# EAGLE design HS(LED)V1 (EAGLE 8.3.0)
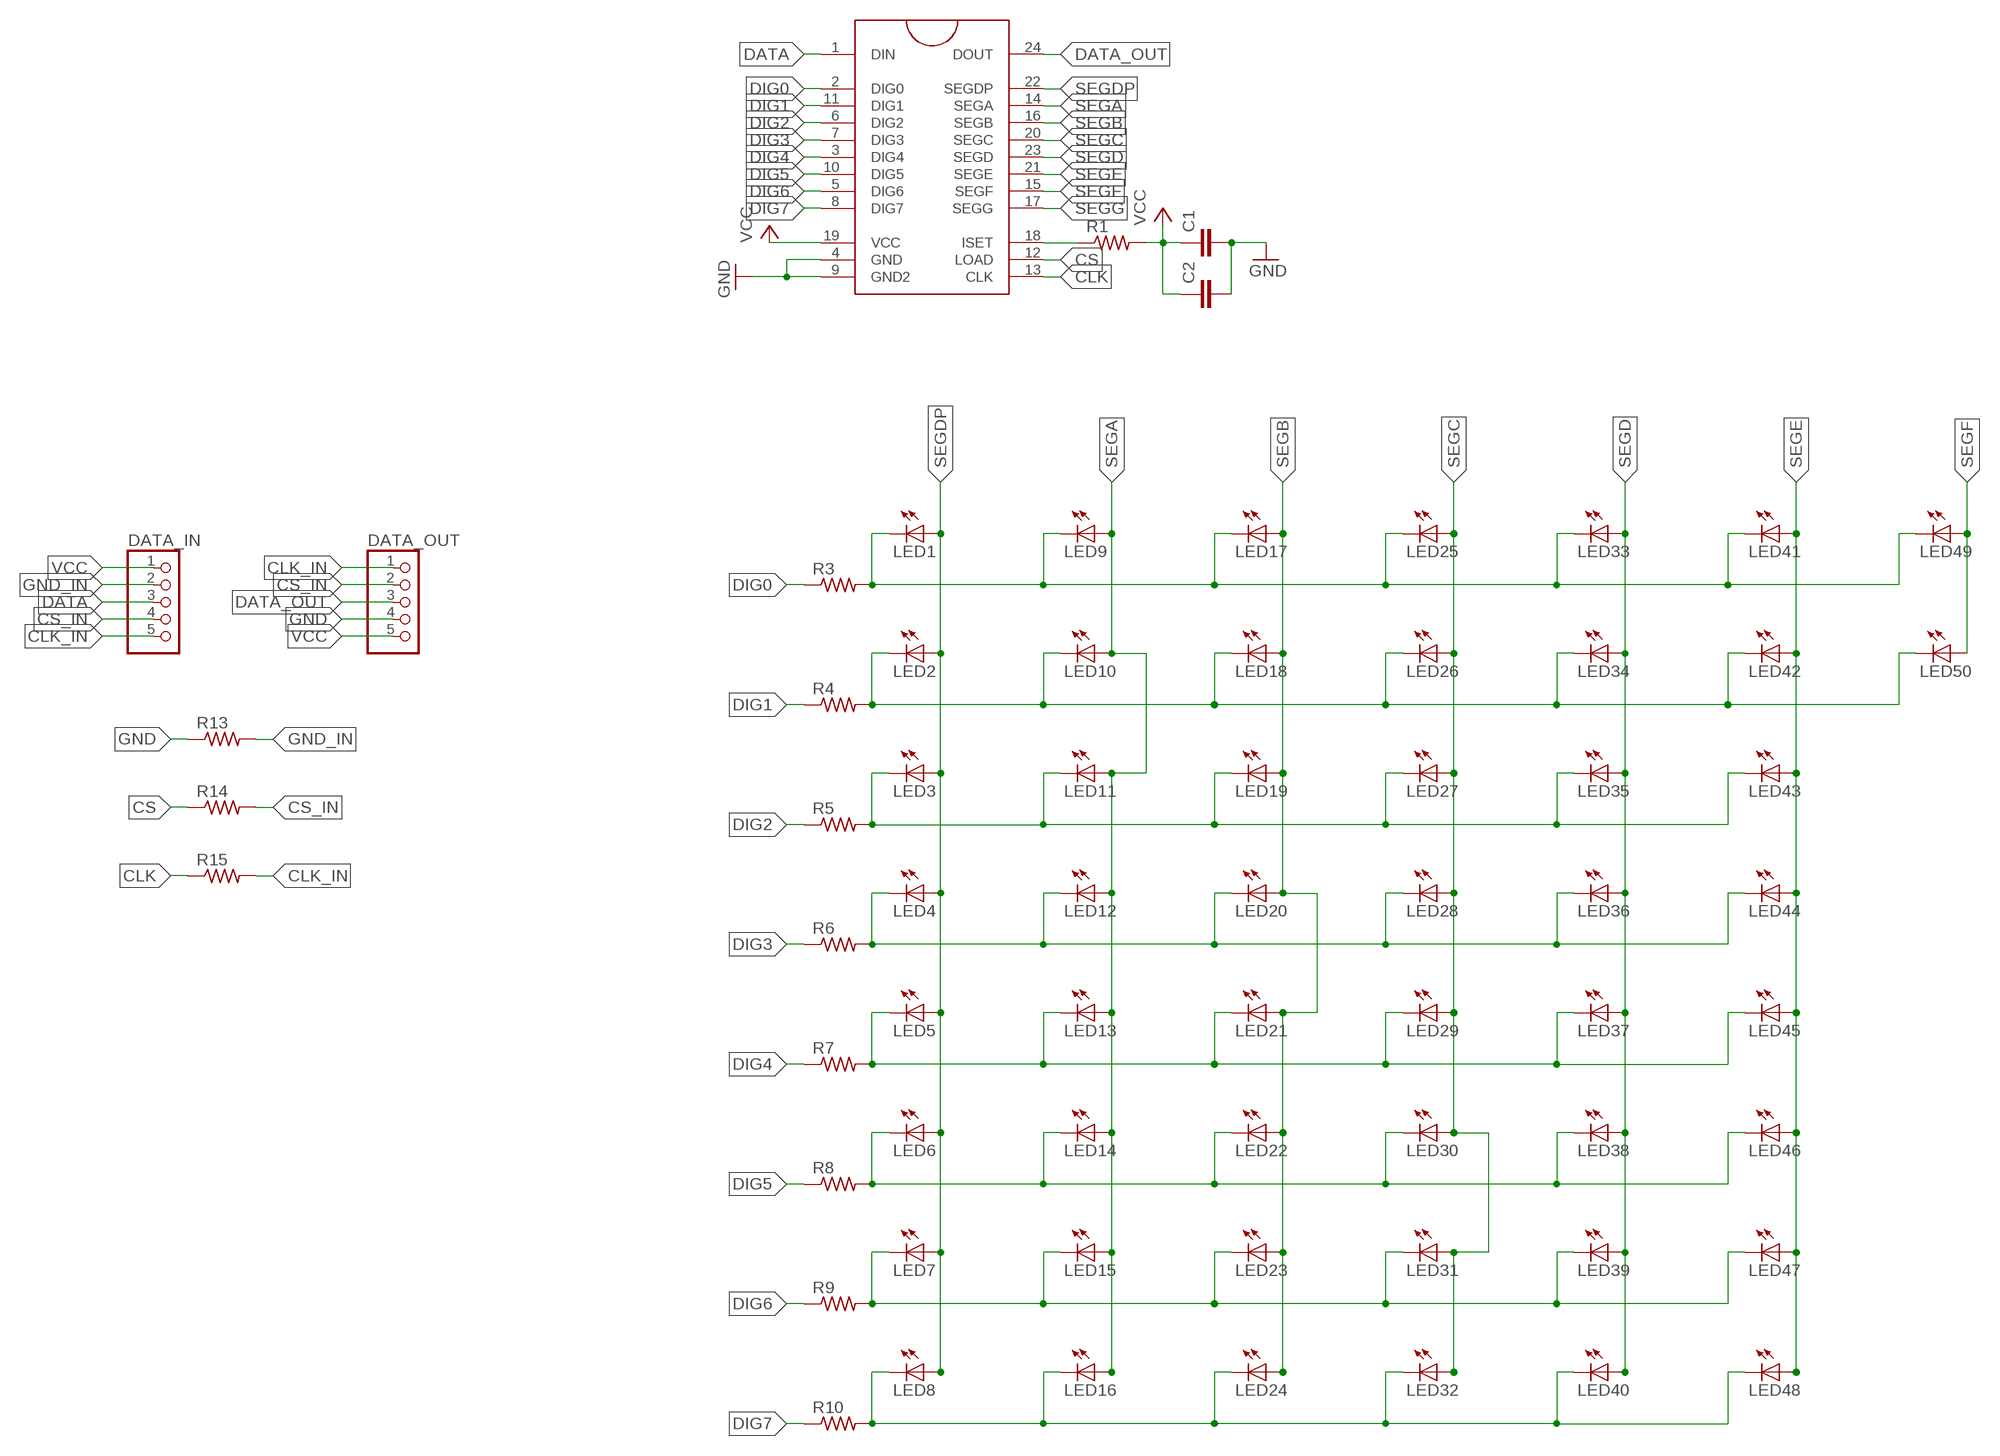
[diagram p0: schematic, sheet 1]

## Parts
C1  C-EU025-024X044  [C025-024X044]
C2  C-EU025-024X044  [C025-024X044]
DATA_IN  PINHD-1X5/90  [1X05/90]
DATA_OUT  PINHD-1X5/90  [1X05/90]
LED1  LED3MM  [LED3MM]
LED2  LED3MM  [LED3MM]
LED3  LED3MM  [LED3MM]
LED4  LED3MM  [LED3MM]
LED5  LED3MM  [LED3MM]
LED6  LED3MM  [LED3MM]
LED7  LED3MM  [LED3MM]
LED8  LED3MM  [LED3MM]
LED9  LED3MM  [LED3MM]
LED10  LED3MM  [LED3MM]
LED11  LED3MM  [LED3MM]
LED12  LED3MM  [LED3MM]
LED13  LED3MM  [LED3MM]
LED14  LED3MM  [LED3MM]
LED15  LED3MM  [LED3MM]
LED16  LED3MM  [LED3MM]
LED17  LED3MM  [LED3MM]
LED18  LED3MM  [LED3MM]
LED19  LED3MM  [LED3MM]
LED20  LED3MM  [LED3MM]
LED21  LED3MM  [LED3MM]
LED22  LED3MM  [LED3MM]
LED23  LED3MM  [LED3MM]
LED24  LED3MM  [LED3MM]
LED25  LED3MM  [LED3MM]
LED26  LED3MM  [LED3MM]
LED27  LED3MM  [LED3MM]
LED28  LED3MM  [LED3MM]
LED29  LED3MM  [LED3MM]
LED30  LED3MM  [LED3MM]
LED31  LED3MM  [LED3MM]
LED32  LED3MM  [LED3MM]
LED33  LED3MM  [LED3MM]
LED34  LED3MM  [LED3MM]
LED35  LED3MM  [LED3MM]
LED36  LED3MM  [LED3MM]
LED37  LED3MM  [LED3MM]
LED38  LED3MM  [LED3MM]
LED39  LED3MM  [LED3MM]
LED40  LED3MM  [LED3MM]
LED41  LED3MM  [LED3MM]
LED42  LED3MM  [LED3MM]
LED43  LED3MM  [LED3MM]
LED44  LED3MM  [LED3MM]
LED45  LED3MM  [LED3MM]
LED46  LED3MM  [LED3MM]
LED47  LED3MM  [LED3MM]
LED48  LED3MM  [LED3MM]
LED49  LED3MM  [LED3MM]
LED50  LED3MM  [LED3MM]
R1  R-US_0207/10  [0207/10]
R3  R-US_0207/10  [0207/10]
R4  R-US_0207/10  [0207/10]
R5  R-US_0207/10  [0207/10]
R6  R-US_0207/10  [0207/10]
R7  R-US_0207/10  [0207/10]
R8  R-US_0207/10  [0207/10]
R9  R-US_0207/10  [0207/10]
R10  R-US_0207/10  [0207/10]
R13  R-US_0207/10  [0207/10]
R14  R-US_0207/10  [0207/10]
R15  R-US_0207/10  [0207/10]
U$1  MAX7219DIP  [DIL24]

## Nets
CLK: R15.1 U$1.13(CLK)
CLK_IN: DATA_IN.5 DATA_OUT.1 R15.2
CS: R14.1 U$1.12(LOAD)
CS_IN: DATA_IN.4 DATA_OUT.2 R14.2
DATA: DATA_IN.3 U$1.1(DIN)
DATA_OUT: DATA_OUT.3 U$1.24(DOUT)
DIG0: R3.1 U$1.2(DIG0)
DIG1: R4.1 U$1.11(DIG1)
DIG2: R5.1 U$1.6(DIG2)
DIG3: R6.1 U$1.7(DIG3)
DIG4: R7.1 U$1.3(DIG4)
DIG5: R8.1 U$1.10(DIG5)
DIG6: R9.1 U$1.5(DIG6)
DIG7: R10.1 U$1.8(DIG7)
GND: C1.2 C2.2 DATA_OUT.4 R13.1 U$1.4(GND) U$1.9(GND2)
GND_IN: DATA_IN.2 R13.2
L0: LED1.K(C) LED9.K(C) LED17.K(C) LED25.K(C) LED33.K(C) LED41.K(C) LED49.K(C) R3.2
L1: LED2.K(C) LED10.K(C) LED18.K(C) LED26.K(C) LED34.K(C) LED42.K(C) LED50.K(C) R4.2
L2: LED3.K(C) LED11.K(C) LED19.K(C) LED27.K(C) LED35.K(C) LED43.K(C) R5.2
L3: LED4.K(C) LED12.K(C) LED20.K(C) LED28.K(C) LED36.K(C) LED44.K(C) R6.2
L4: LED5.K(C) LED13.K(C) LED21.K(C) LED29.K(C) LED37.K(C) LED45.K(C) R7.2
L5: LED6.K(C) LED14.K(C) LED22.K(C) LED30.K(C) LED38.K(C) LED46.K(C) R8.2
L6: LED7.K(C) LED15.K(C) LED23.K(C) LED31.K(C) LED39.K(C) LED47.K(C) R9.2
L7: LED8.K(C) LED16.K(C) LED24.K(C) LED32.K(C) LED40.K(C) LED48.K(C) R10.2
N$18: R1.1 U$1.18(ISET)
SEGA: LED9.A LED10.A LED11.A LED12.A LED13.A LED14.A LED15.A LED16.A U$1.14(SEGA)
SEGB: LED17.A LED18.A LED19.A LED20.A LED21.A LED22.A LED23.A LED24.A U$1.16(SEGB)
SEGC: LED25.A LED26.A LED27.A LED28.A LED29.A LED30.A LED31.A LED32.A U$1.20(SEGC)
SEGD: LED33.A LED34.A LED35.A LED36.A LED37.A LED38.A LED39.A LED40.A U$1.23(SEGD)
SEGDP: LED1.A LED2.A LED3.A LED4.A LED5.A LED6.A LED7.A LED8.A U$1.22(SEGDP)
SEGE: LED41.A LED42.A LED43.A LED44.A LED45.A LED46.A LED47.A LED48.A U$1.21(SEGE)
SEGF: LED49.A LED50.A U$1.15(SEGF)
SEGG: U$1.17(SEGG)
VCC: C1.1 C2.1 DATA_IN.1 DATA_OUT.5 R1.2 U$1.19(VCC)

## Library data of the parts
C1 C2 = resistor:C-EU: CAPACITOR, European symbol
DATA_IN DATA_OUT = pinhead:PINHD-1X5: PIN HEADER
LED1-LED50 = led:LED: LED OSRAM: - CHIPLED LG R971, LG N971, LY N971, LG Q971, LY Q971, LO R971, LY R971 LH N974, LH R974 LS Q976, LO Q976, LY Q976 LO Q996 - Hyper CHIPLED LW Q18S LB Q993, LB Q99A, LB R99A - SideLED LS A670, LO A670, LY A670, LG A670, LP A670 LB A673, LV A673, LT A673, LW A673 LH A674 LY A675 LS A676, LA A676, LO A676, LY A676, LW A676 LS A679, LY A679, LG A679 - Hyper Micro SIDELED® LS Y876, LA Y876, LO Y876, LY Y876 LT Y87S - SmartLED LW L88C, LW L88S LB L89C, LB L89S, LG L890 LS L89K, LO L89K, LY L89K LS L896, LA L896, LO L896, LY L896 - TOPLED LS T670, LO T670, LY T670, LG T670, LP T670 LSG T670, LSP T670, LSY T670, LOP T670, LYG T670 LG T671, LOG T671, LSG T671 LB T673, LV T673, LT T673, LW T673 LH T674 LS T676, LA T676, LO T676, LY T676, LB T676, LH T676, LSB T676, LW T676 LB T67C, LV T67C, LT T67C, LS T67K, LO T67K, LY T67K, LW E67C LS E67B, LA E67B, LO E67B, LY E67B, LB E67C, LV E67C, LT E67C LW T67C LS T679, LY T679, LG T679 LS T770, LO T770, LY T770, LG T770, LP T770 LB T773, LV T773, LT T773, LW T773 LH T774 LS E675, LA E675, LY E675, LS T675 LS T776, LA T776, LO T776, LY T776, LB T776 LHGB T686 LT T68C, LB T68C - Hyper Mini TOPLED® LB M676 - Mini TOPLED Santana® LG M470 LS M47K, LO M47K, LY M47K Source: http://www.osram.convergy.de LUXEON: - LUMILED® LXK2-PW12-R00, LXK2-PW12-S00, LXK2-PW14-U00, LXK2-PW14-V00 LXK2-PM12-R00, LXK2-PM12-S00, LXK2-PM14-U00 LXK2-PE12-Q00, LXK2-PE12-R00, LXK2-PE12-S00, LXK2-PE14-T00, LXK2-PE14-U00 LXK2-PB12-K00, LXK2-PB12-L00, LXK2-PB12-M00, LXK2-PB14-N00, LXK2-PB14-P00, LXK2-PB14-Q00 LXK2-PR12-L00, LXK2-PR12-M00, LXK2-PR14-Q00, LXK2-PR14-R00 LXK2-PD12-Q00, LXK2-PD12-R00, LXK2-PD12-S00 LXK2-PH12-R00, LXK2-PH12-S00 LXK2-PL12-P00, LXK2-PL12-Q00, LXK2-PL12-R00 Source: www.luxeon.com KINGBRIGHT: KA-3528ASYC Source: www.kingbright.com
R1 R3-R10 R13-R15 = adafruit:R-US_: RESISTOR, American symbol
U$1 = MAXIM:MAX7219

## Net classes
0 default: width 0.15 mm, drill 0.3 mm, clearance 0.15 mm

## Board
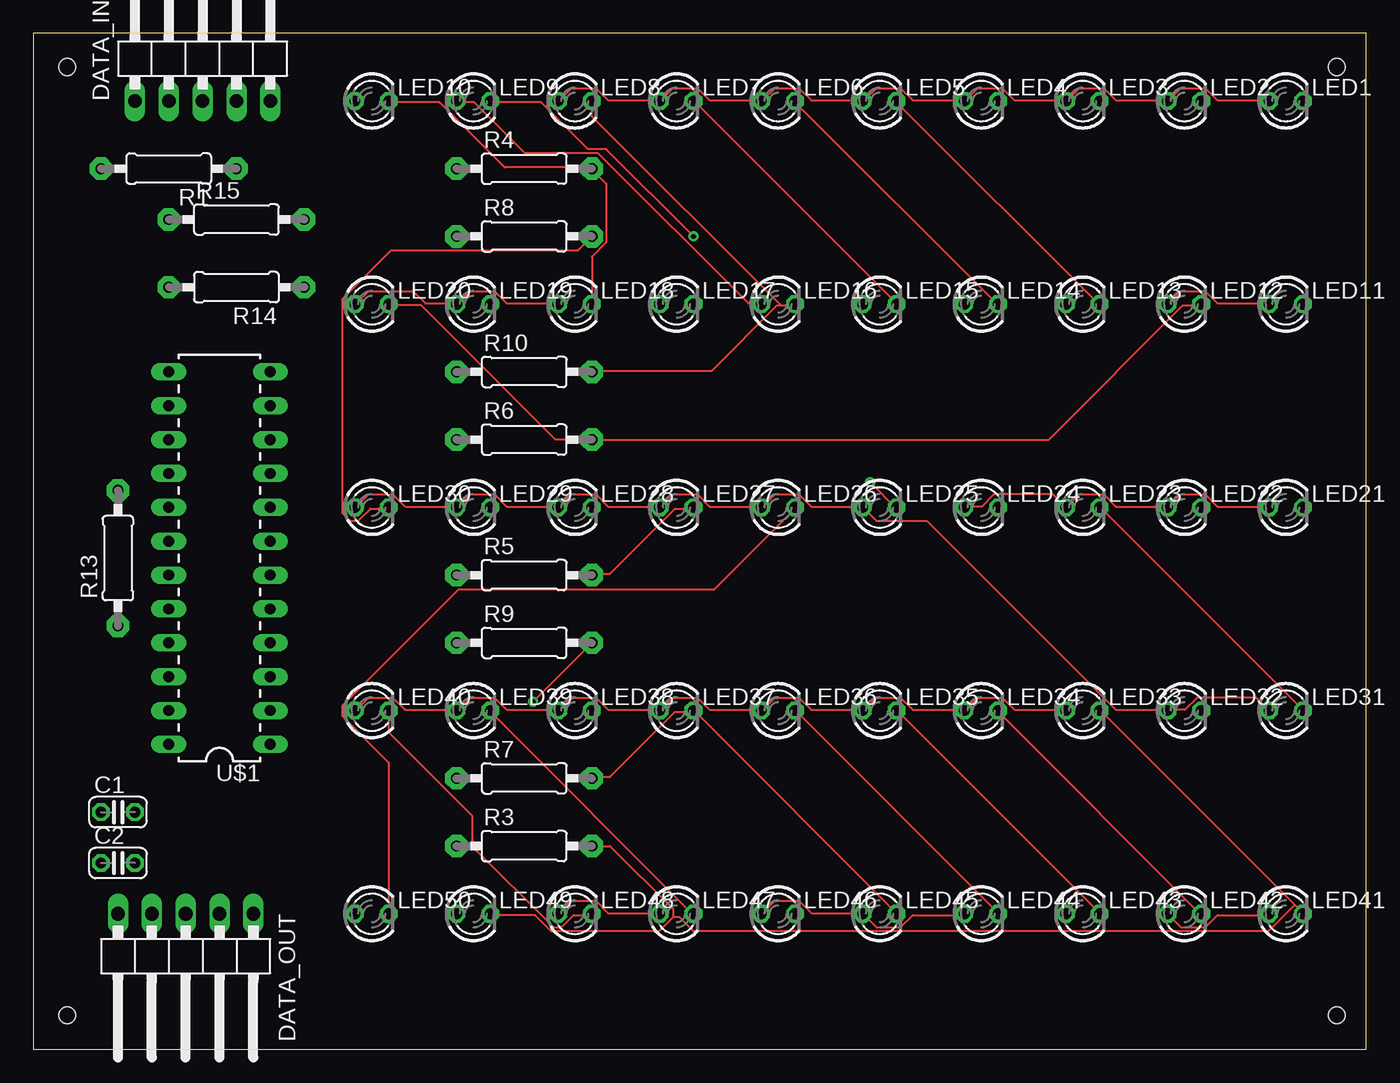
[diagram p1: board, top side]
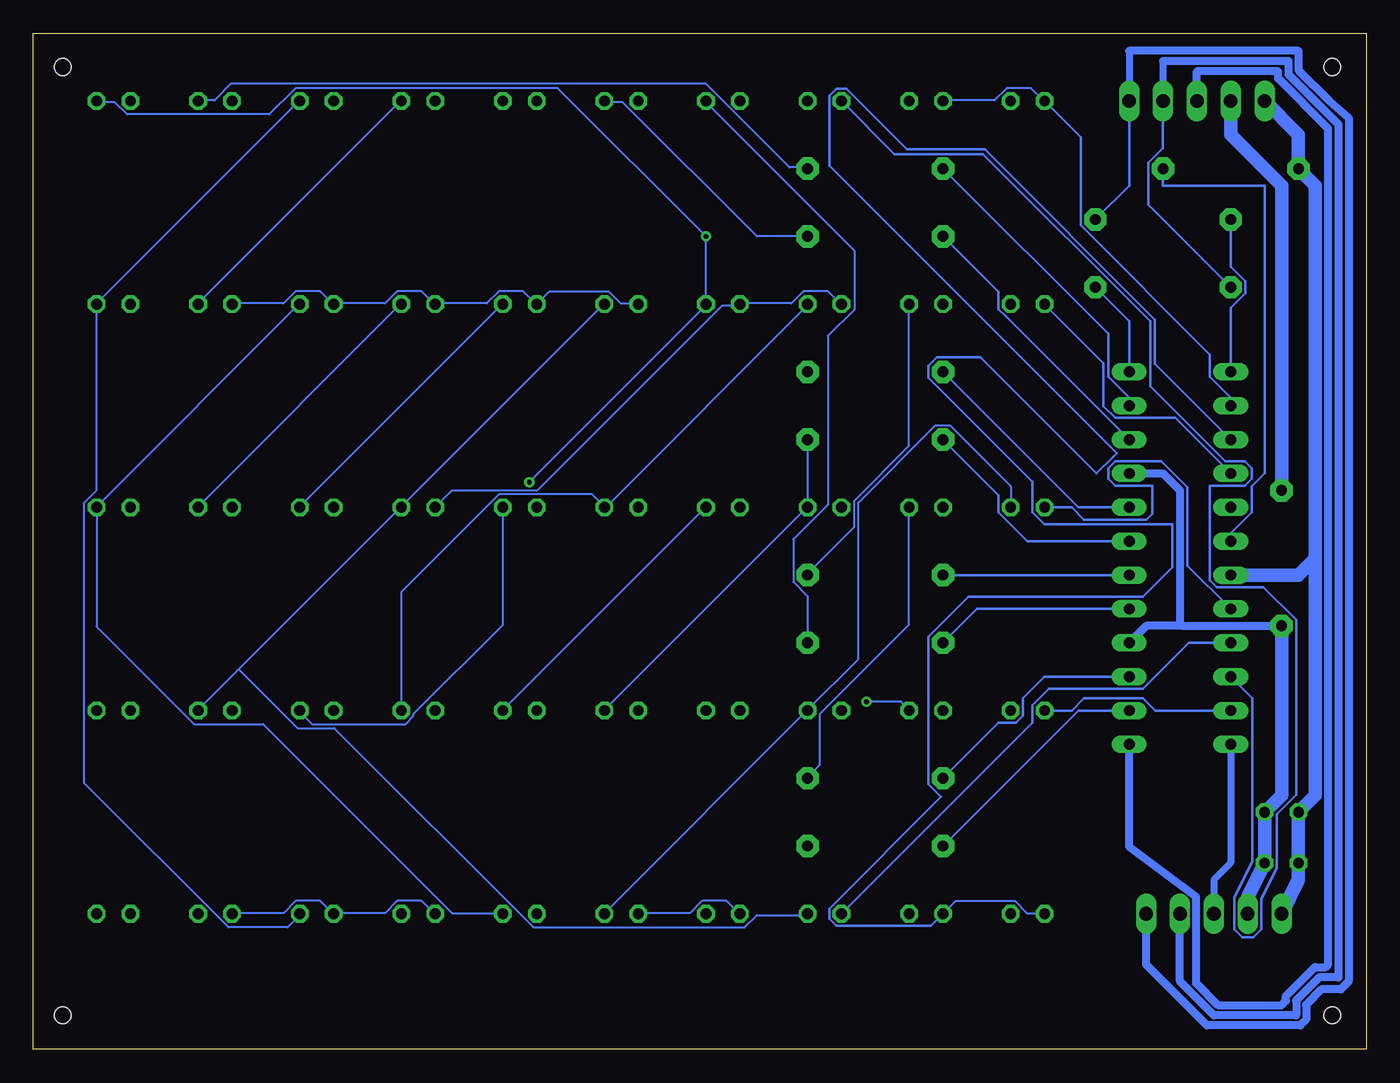
[diagram p2: board, bottom side, seen from below]

Size 100 x 76.19 mm. Coordinates in mm from the lower left corner, seen from the top.
Outline: 0,0 100,0 100,76.19 0,76.19 0,0
Copper layers (1*16): Top 0.035mm / dielectric 1.5mm / Bottom 0.035mm
Design rules "default": minimum track width 6mil, minimum drill 0.35mm, track to track 6mil, track to pad 6mil, pad to pad 6mil, via to via 6mil, smd to smd 6mil, copper to edge 40mil, drill to drill 6mil, minimum pad ring 10mil, minimum via ring 8mil, stop-mask expansion 4mil, vias tented up to drill 0mil, thermal gap 10mil
Holes 1.27 mm at 2.54,73.66 2.54,2.54 97.79,2.54 97.79,73.66

### Footprints (pad centres in the part's own frame; a part is rotated, then mirrored left to right if it is on the bottom)
C025-024X044 = drill 0.813 octagon: 1 -1.27,0; 2 1.27,0
1X05/90 = drill 1.016 long: 1 -5.08,-3.81; 2 -2.54,-3.81; 3 0,-3.81; 4 2.54,-3.81; 5 5.08,-3.81
LED3MM = drill 0.813 octagon: A -1.27,0; K 1.27,0
0207/10 = drill 0.813 pad 1.676 octagon: 1 -5.08,0; 2 5.08,0
DIL24 = drill 0.813 long: 1 -13.97,-3.81; 2 -11.43,-3.81; 3 -8.89,-3.81; 4 -6.35,-3.81; 5 -3.81,-3.81; 6 -1.27,-3.81; 7 1.27,-3.81; 8 3.81,-3.81; 9 6.35,-3.81; 10 8.89,-3.81; 11 11.43,-3.81; 12 13.97,-3.81; 13 13.97,3.81; 14 11.43,3.81; 15 8.89,3.81; 16 6.35,3.81; 17 3.81,3.81; 18 1.27,3.81; 19 -1.27,3.81; 20 -3.81,3.81; 21 -6.35,3.81; 22 -8.89,3.81; 23 -11.43,3.81; 24 -13.97,3.81

### Placement (x,y rotation side)
C1  6.35,17.78 0 top
C2  6.35,13.97 0 top
DATA_IN  12.7,74.93 0 top
DATA_OUT  11.43,6.35 180 top
LED1  93.98,71.12 0 top
LED2  86.36,71.12 0 top
LED3  78.74,71.12 0 top
LED4  71.12,71.12 0 top
LED5  63.5,71.12 0 top
LED6  55.88,71.12 0 top
LED7  48.26,71.12 0 top
LED8  40.64,71.12 0 top
LED9  33.02,71.12 0 top
LED10  25.4,71.12 0 top
LED11  93.98,55.88 0 top
LED12  86.36,55.88 0 top
LED13  78.74,55.88 0 top
LED14  71.12,55.88 0 top
LED15  63.5,55.88 0 top
LED16  55.88,55.88 0 top
LED17  48.26,55.88 0 top
LED18  40.64,55.88 0 top
LED19  33.02,55.88 0 top
LED20  25.4,55.88 0 top
LED21  93.98,40.64 0 top
LED22  86.36,40.64 0 top
LED23  78.74,40.64 0 top
LED24  71.12,40.64 0 top
LED25  63.5,40.64 0 top
LED26  55.88,40.64 0 top
LED27  48.26,40.64 0 top
LED28  40.64,40.64 0 top
LED29  33.02,40.64 0 top
LED30  25.4,40.64 0 top
LED31  93.98,25.4 0 top
LED32  86.36,25.4 0 top
LED33  78.74,25.4 0 top
LED34  71.12,25.4 0 top
LED35  63.5,25.4 0 top
LED36  55.88,25.4 0 top
LED37  48.26,25.4 0 top
LED38  40.64,25.4 0 top
LED39  33.02,25.4 0 top
LED40  25.4,25.4 0 top
LED41  93.98,10.16 0 top
LED42  86.36,10.16 0 top
LED43  78.74,10.16 0 top
LED44  71.12,10.16 0 top
LED45  63.5,10.16 0 top
LED46  55.88,10.16 0 top
LED47  48.26,10.16 0 top
LED48  40.64,10.16 0 top
LED49  33.02,10.16 0 top
LED50  25.4,10.16 0 top
R1  10.16,66.04 180 top
R3  36.83,15.24 0 top
R4  36.83,66.04 0 top
R5  36.83,35.56 0 top
R6  36.83,45.72 0 top
R7  36.83,20.32 0 top
R8  36.83,60.96 0 top
R9  36.83,30.48 0 top
R10  36.83,50.8 0 top
R13  6.35,36.83 90 top
R14  15.24,57.15 180 top
R15  15.24,62.23 0 top
U$1  13.97,36.83 90 top

### Tracks (layer width: path | path; a pad name or v marks a point on that pad's centre or on a via)
CLK
  Bottom 0.2: R15.1 10.16,58.69 9.07,57.6 9.07,56.7 10.16,55.61 U$1.13
CLK_IN
  Bottom 0.2: DATA_IN.5 17.78,64.77 R15.2
  Bottom 0.508: 17.78,74.87 DATA_IN.5
  Bottom 0.61: 17.78,74.87 5.08,74.87 5.08,73.43 2.77,71.12 1.32,69.85 1.32,5.08 1.91,4.5 3.35,4.5 4.5,3.35 4.5,2.22 4.94,1.78 11.94,1.78 16.51,6.35 DATA_OUT.1
CS
  Bottom 0.2: U$1.12 17.78,54.61 R14.1
CS_IN
  Bottom 0.2: DATA_IN.4 15.24,67.58 16.33,66.49 16.33,63.32 R14.2
  Bottom 0.508: 15.24,74.11 DATA_IN.4
  Bottom 0.61: 15.24,74.11 5.84,74.11 5.84,73.12 2.08,69.36 2.08,5.4 3.53,5.4 5.26,3.67 5.26,2.54 11.43,2.54 13.97,5.08 DATA_OUT.2
DATA
  Bottom 0.61: DATA_IN.3 12.7,73.34 6.6,73.34 6.6,72.8 2.85,69.04 2.85,6.35 3.04,6.16 3.84,6.16 6.02,3.98 6.02,3.63 6.35,3.3 11.11,3.3 12.75,4.94 12.75,11.43 17.78,15.19 U$1.1
DATA_OUT
  Bottom 0.508: U$1.24 10.16,13.97 11.43,12.7 DATA_OUT.3
DIG0
  Bottom 0.2: U$1.2 21.59,25.4 R3.1
DIG1
  Bottom 0.2: U$1.11 17.78,48.85 19.35,50.42 19.35,53.64 R4.1
DIG2
  Bottom 0.2: U$1.6 R5.1
DIG3
  Bottom 0.2: R6.1 27.58,41.55 27.58,40.26 25.42,38.1 U$1.7
DIG4
  Bottom 0.2: U$1.3 24.13,27.94 25.76,26.31 25.76,25.02 26.29,24.49 27.58,24.49 R7.1
DIG5
  Bottom 0.2: R8.1 27.58,56.79 27.58,55.5 27.05,54.97 27.03,54.97 U$1.10
DIG6
  Bottom 0.2: U$1.5 29.21,33.02 R9.1
DIG7
  Bottom 0.2: U$1.8 21.59,40.64 R10.1
GND
  Bottom 0.61: U$1.4 16.51,31.75 13.78,31.75 | 13.78,31.75 R13.1 | U$1.9 15.24,43.18 13.97,41.91 13.97,31.94 13.78,31.75
  Bottom 1.016: DATA_OUT.4 8.89,11.43 C2.2 C1.2 6.35,19.05 R13.1
GND_IN
  Bottom 1.016: R13.2 6.35,64.77 10.16,68.58 DATA_IN.2
L0  (via drill 0.35)
  Top 0.152: 48.01,9.91 46.94,8.84 38.86,8.84 37.64,10.06 34.29,10.06 LED49.K | 48.01,9.91 48.01,10.52 43.28,15.24 R3.2 | 94.64,10.82 80.01,25.45 LED33.K | 94.64,10.82 95.25,10.21 LED41.K | v62.79,42.52 64.77,40.54 LED25.K | v49.53,60.96 42.98,67.51 41.6,67.51 38.1,71.02 34.29,71.02 LED9.K | 48.01,9.91 48.46,9.91 49.53,8.84 92.66,8.84 94.64,10.82
  Bottom 0.152: LED25.K 64.77,31.85 71.48,25.15 71.48,24.99 72.08,24.38 79.1,24.38 80.01,25.3 LED33.K | v62.79,42.52 49.53,55.78 LED17.K v49.53,60.96 60.66,72.08 80.31,72.08 82.3,70.1 92.96,70.1 93.88,71.02 95.25,71.02 LED1.K
L1
  Top 0.152: LED18.K 41.91,59.44 42.98,60.5 42.98,64.92 41.91,65.99 R4.2 41.91,66.14 35.36,66.14 30.48,71.02 26.67,71.02 LED10.K | LED34.K 72.39,25.3 87.63,10.06 LED42.K | LED50.K 26.67,21.49 23.16,24.99 23.16,25.76 31.85,34.44 51.05,34.44 57.15,40.54 LED26.K
  Bottom 0.152: LED2.K 87.63,71.17 86.41,71.17 85.19,72.39 49.53,72.39 43.28,66.14 41.91,66.14 R4.2 | LED34.K 72.39,34.29 65.08,41.6 58.06,41.6 57.15,40.69 LED26.K 57.15,40.54 41.91,55.78 LED18.K
L2
  Top 0.152: LED27.K 49.53,40.54 48.16,40.54 43.28,35.66 41.91,35.66 R5.2 | LED43.K 80.01,10.21 64.77,25.45 LED35.K
  Bottom 0.152: LED3.K 80.01,71.17 95.25,55.93 LED11.K 95.25,41.91 96.16,41 96.16,19.96 85.34,9.14 80.92,9.14 80.01,10.06 LED43.K | LED19.K 34.29,45.26 38.41,41.15 38.41,39.17 41.91,35.66 R5.2 | LED35.K 64.77,25.45 49.53,40.69 LED27.K
L3
  Top 0.152: LED20.K 26.67,55.78 29.11,55.78 39.17,45.72 R6.2 76.2,45.72 86.26,55.78 87.63,55.78 LED12.K | LED44.K 72.39,10.21 57.15,25.45 LED36.K
  Bottom 0.152: LED12.K 87.63,55.93 72.39,71.17 LED4.K | R6.2 41.91,40.69 | 41.91,40.69 57.15,25.45 LED36.K | 41.91,40.69 LED28.K
L4
  Top 0.152: R7.2 41.91,20.42 43.28,20.42 48.16,25.3 49.53,25.3 LED37.K 49.53,25.45 64.77,10.21 LED45.K | LED5.K 64.77,71.02 80.01,55.78 LED13.K
  Bottom 0.152: LED29.K 34.29,31.85 41,25.15 41,21.34 41.91,20.42 R7.2 | LED13.K 80.01,55.93 95.25,40.69 LED21.K 95.25,31.7 87.94,24.38 82.75,24.38 68.58,10.21 64.77,10.21 LED45.K
L5
  Top 0.152: LED6.K 57.15,71.02 72.39,55.78 LED14.K | R8.2 40.84,59.89 26.82,59.89 23.16,56.24 23.16,40.23 23.77,39.62 24.38,39.62 25.3,40.54 26.67,40.54 LED30.K
  Bottom 0.152: 41.91,25.45 57.15,10.21 LED46.K | LED30.K 26.67,42.21 31.24,46.79 32.31,46.79 38.1,41 38.1,29.26 41.91,25.45 | 41.91,25.45 LED38.K | R8.2 45.72,60.96 55.78,71.02 57.15,71.02 LED6.K | LED22.K 87.63,40.69 72.39,55.93 LED14.K
L6  (via drill 0.35)
  Top 0.152: LED39.K 34.29,25.3 49.53,10.06 LED47.K | v37.49,26.06 R9.2 | LED31.K 95.25,25.45 80.01,40.69 LED23.K | LED15.K 64.77,55.93 49.53,71.17 LED7.K
  Bottom 0.152: v37.49,26.06 34.9,26.06 34.29,25.45 LED39.K | LED23.K 80.01,40.69 64.77,55.93 LED15.K | R9.2 41.91,33.98 42.98,35.05 42.98,38.25 40.39,40.84 40.39,53.49 38.41,55.47 38.41,59.89 49.53,71.02 LED7.K
L7
  Top 0.152: LED40.K 26.67,23.77 32.92,17.53 32.92,15.24 39.01,9.14 39.62,9.14 40.54,10.06 41.91,10.06 LED48.K | 56.08,55.78 55.78,55.78 50.9,50.9 41.91,50.9 R10.2 | 56.08,55.78 57.15,55.78 LED16.K | LED8.K 41.91,69.95 56.08,55.78
  Bottom 0.152: 72.39,40.69 57.15,55.93 LED16.K | 72.39,40.69 84.58,28.5 | 84.58,28.5 87.63,25.45 LED32.K | 72.39,40.69 LED24.K | 84.58,28.5 80.16,24.08 77.42,24.08 62.48,9.14 46.63,9.14 45.72,10.06 41.91,10.06 LED48.K
N$18
  Bottom 0.2: R1.1 15.24,64.77 7.62,64.77 7.62,43.18 8.59,42.21 8.59,40.26 10.16,38.69 U$1.18
SEGA
  Top 0.152: LED11.A 92.66,55.93 88.85,55.93 87.94,56.84 86.11,56.84 85.19,55.93 LED12.A | LED9.A 31.85,71.02 33.07,71.02 36.88,67.21 42.37,67.21 53.65,55.93 54.56,55.93 LED16.A
  Bottom 0.152: LED9.A 31.7,71.17 27.89,71.17 26.98,72.08 25.15,72.08 24.23,71.17 LED10.A | LED16.A 54.71,55.93 55.93,55.93 56.84,56.84 61.27,56.84 LED15.A 62.33,55.93 63.25,56.84 65.08,56.84 65.99,55.93 69.8,55.93 LED14.A 69.95,55.93 70.87,56.84 72.69,56.84 73.61,55.93 77.42,55.93 LED13.A 77.57,55.93 78.49,56.84 80.31,56.84 81.23,55.93 85.04,55.93 LED12.A
  Bottom 0.2: U$1.14 10.16,48.85 11.73,50.42 11.73,52.1 21.41,61.78 21.41,68.4 LED10.A
SEGB
  Top 0.152: LED20.A 24.23,55.93 25.15,56.84 28.5,56.84 29.41,55.93 31.7,55.93 LED19.A 31.85,55.93 32.77,56.84 34.59,56.84 35.51,55.93 39.32,55.93 LED18.A | LED24.A 69.95,40.69 71.17,40.69 72.08,41.6 76.5,41.6 LED23.A 77.57,40.69 78.49,41.6 80.31,41.6 81.23,40.69 85.04,40.69 LED22.A 85.19,40.69 86.11,41.6 87.94,41.6 88.85,40.69 92.66,40.69 LED21.A
  Bottom 0.152: LED18.A 39.47,55.93 40.39,56.84 42.22,56.84 43.13,55.93 46.94,55.93 LED17.A 47.09,55.78 48.31,55.78 62.18,41.91 68.58,41.91 LED24.A
  Bottom 0.2: LED20.A 19.71,51.46 19.71,48.23 18.82,47.35 14.33,47.35 U$1.16
SEGC
  Top 0.152: LED31.A 91.75,26.37 87.33,26.37 86.41,25.45 85.19,25.45 LED32.A 85.04,25.45 81.23,25.45 67.06,39.62 63.25,39.62 LED25.A 62.18,40.69 58.37,40.69 57.45,41.6 55.63,41.6 54.71,40.69 LED26.A 54.56,40.69 50.75,40.69 49.84,41.6 48.01,41.6 47.09,40.69 LED27.A 46.94,40.69 43.13,40.69 42.22,41.6 40.39,41.6 39.47,40.69 LED28.A 39.32,40.69 35.51,40.69 34.59,41.6 32.77,41.6 31.85,40.69 LED29.A 31.7,40.69 27.89,40.69 26.98,41.6 25.15,41.6 24.23,40.69 LED30.A
  Bottom 0.2: LED30.A 22.09,40.64 21.18,39.73 16.48,39.73 16.03,40.18 16.03,42.27 18.82,42.27 19.35,42.8 19.35,43.56 18.82,44.09 15.37,44.09 13.41,42.14 13.41,36.27 U$1.20
SEGD
  Top 0.152: LED40.A 24.23,25.45 25.15,26.37 26.98,26.37 27.89,25.45 31.7,25.45 LED39.A 31.85,25.45 32.77,26.37 34.59,26.37 35.51,25.45 39.32,25.45 LED38.A 39.47,25.45 40.39,26.37 42.22,26.37 43.13,25.45 46.94,25.45 LED37.A 47.09,25.45 48.01,26.37 49.84,26.37 50.75,25.45 54.56,25.45 LED36.A 54.71,25.45 55.63,26.37 57.45,26.37 58.37,25.45 62.18,25.45 LED35.A 62.33,25.45 63.25,26.37 65.08,26.37 65.99,25.45 69.8,25.45 LED34.A 69.95,25.45 70.87,26.37 72.69,26.37 73.61,25.45 77.42,25.45 LED33.A
  Bottom 0.2: LED40.A 22.09,25.4 21.18,26.31 16.74,26.31 15.83,25.4 U$1.23
SEGDP
  Top 0.152: LED8.A 39.47,71.17 40.39,72.08 42.22,72.08 43.13,71.17 46.94,71.17 LED7.A 47.09,71.17 48.01,72.08 49.84,72.08 50.75,71.17 54.56,71.17 LED6.A 54.71,71.17 55.63,72.08 57.45,72.08 58.37,71.17 62.18,71.17 LED5.A 62.33,71.17 63.25,72.08 65.08,72.08 65.99,71.17 69.8,71.17 LED4.A 69.95,71.17 70.87,72.08 72.69,72.08 73.61,71.17 77.42,71.17 LED3.A 77.57,71.17 78.49,72.08 80.31,72.08 81.23,71.17 85.04,71.17 LED2.A 85.19,71.17 86.11,72.08 87.94,72.08 88.85,71.17 92.66,71.17 LED1.A
  Bottom 0.2: U$1.22 8.53,26.31 8.53,14.08 9.9,11.34 9.9,8.98 9.31,8.38 8.47,8.38 7.88,8.98 7.88,11.25 6.71,13.59 6.71,17.62 5.26,19.07 5.26,32.2 7.71,34.65 11.2,34.65 11.73,35.18 11.73,42.27 9.12,42.27 8.59,42.8 8.59,43.56 9.12,44.09 10.57,44.09 16.21,49.72 16.21,54.58 28.76,67.13 35.38,67.13 LED8.A
SEGE
  Top 0.152: LED47.A 46.94,10.21 43.13,10.21 42.22,11.12 40.39,11.12 39.47,10.21 LED48.A | LED46.A 54.71,10.21 55.63,11.12 57.45,11.12 58.37,10.21 62.18,10.21 LED45.A 63.25,9.14 65.08,9.14 65.99,10.06 69.8,10.06 LED44.A | LED42.A 86.11,9.14 87.94,9.14 88.85,10.06 92.66,10.06 LED41.A
  Bottom 0.152: 54.56,10.06 LED46.A 54.56,10.21 50.75,10.21 49.84,11.12 48.01,11.12 47.09,10.21 LED47.A | LED44.A 69.95,10.21 70.87,11.12 72.69,11.12 73.61,10.21 77.42,10.21 LED43.A 77.57,10.21 78.49,11.12 80.31,11.12 81.23,10.21 85.04,10.21 LED42.A
  Bottom 0.2: LED48.A 25.04,24.49 25.04,25.78 23.79,27.03 16.74,27.03 13.29,30.48 U$1.21
SEGF
  Bottom 0.152: LED49.A 30.79,11.12 26.36,11.12 25.45,10.21 24.23,10.21 LED50.A
  Bottom 0.2: U$1.15 15.85,51.41 15.85,54.72 28.61,67.48 34.44,67.48 38.99,72.03 39.75,72.03 40.28,71.5 40.28,66.27 18.71,44.7 18.96,44.45 20.23,43.18 28.94,51.89 32.2,51.89 32.84,51.25 32.84,50.35 25.04,42.55 25.04,40.26 24.16,39.38 14.53,39.38 14.53,36.15 16.74,33.93 29.84,33.93 32.84,30.93 32.84,19.87 31.9,18.92 40.28,10.54 40.28,9.78 39.75,9.25 32.66,9.25 LED49.A
VCC
  Bottom 1.016: DATA_OUT.5 5.08,12.7 C2.1 C1.1 3.81,19.05 3.81,36.83 | DATA_IN.1 5.08,68.58 R1.2 3.81,64.77 3.81,36.83 | U$1.19 5.08,35.56 3.81,36.83